# EAGLE design clk_shield (EAGLE 7.2.0)
CNAME: Arduino RTC shield; CREVISION: 001; DESIGNER: M.Vagovszky
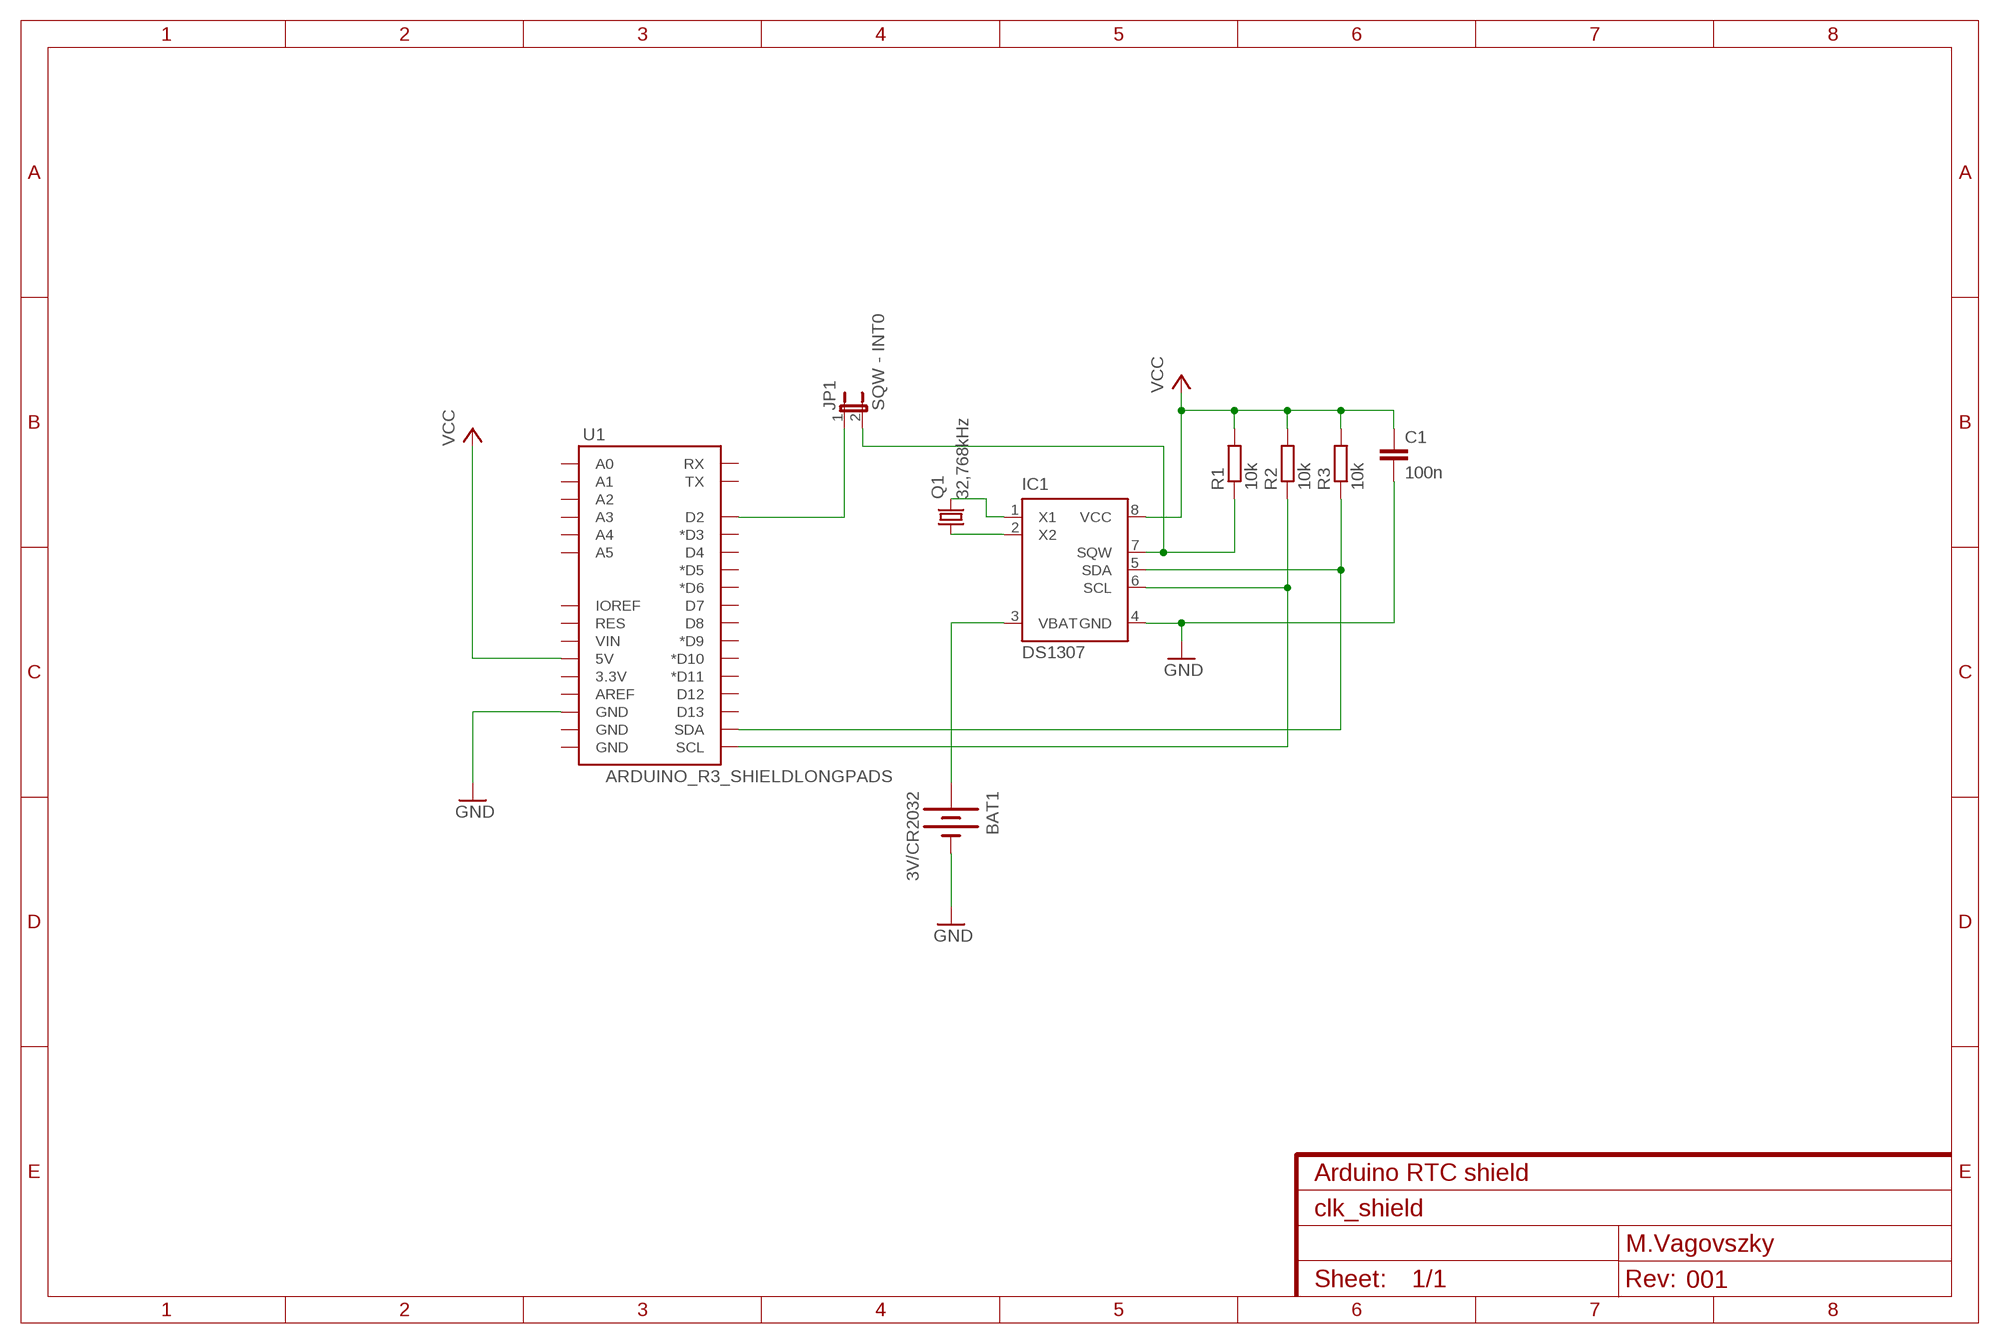
[diagram p0: schematic, sheet 1]

## Parts
BAT1  3V/CR2032  BATTERY20PTH  [BATTCOM_20MM_PTH]
C1  100n  C-EU050-025X075  [C050-025X075]
IC1  DS1307  [DIP-8]
JP1  SQW - INT0  JUMPER-2PTH  [1X02]
Q1  32,768kHz  CRYSTALTC26H  [TC26H]
R1  10k  R-EU_0207/12  [0207/12]
R2  10k  R-EU_0207/12  [0207/12]
R3  10k  R-EU_0207/12  [0207/12]
U1  ARDUINO_R3_SHIELDLONGPADS  [UNO_R3_SHIELD_LONGPADS]

## Nets
GND: BAT1.2(-) C1.2 IC1.4(GND) U1.GND@2(GND)
N$1: BAT1.1(+) IC1.3(VBAT)
N$2: IC1.1(X1) Q1.2
N$3: IC1.2(X2) Q1.1
N$5: IC1.6(SCL) R2.1 U1.SCL
N$6: IC1.5(SDA) R3.1 U1.SDA
N$7: JP1.1 U1.D2
N$8: IC1.7(SQW) JP1.2 R1.1
VCC: C1.1 IC1.8(VCC) R1.2 R2.2 R3.2 U1.5V
Unconnected: U1.3.3V U1.A0 U1.A1 U1.A2 U1.A3 U1.A4 U1.A5 U1.AREF U1.D3(*D3) U1.D4 U1.D5(*D5) U1.D6(*D6) U1.D7 U1.D8 U1.D9(*D9) U1.D10(*D10) U1.D11(*D11) U1.D12 U1.D13 U1.GND@0(GND) U1.GND@1(GND) U1.IOREF U1.RES U1.RX U1.TX U1.VIN

## Library data of the parts
BAT1 = My-Electromechanical:BATTERY: Battery Holders Various common sizes : AA, AAA, 20mm coin cell and 12mm coin cell. 20MM_4LEGS, BATT-10373
C1 = my_rcl:C-EU: CAPACITOR, European symbol
IC1 = DS1307:DS1307: DS1307 - 64×8, Serial, I2C Real Time Clock
JP1 = SparkFun-Retired:JUMPER-2: Jumper Basic 0.1" spaced jumper. Use with breakaway headers.
Q1 = my_crystal:CRYSTAL: CRYSTAL; OC_FARNELL: unknown; OC_NEWARK: unknown
R1-R3 = my_rcl:R-EU_: RESISTOR, European symbol
U1 = My:ARDUINO_R3_SHIELD: Shield form compatible with the Arduino Uno R3.

## Board
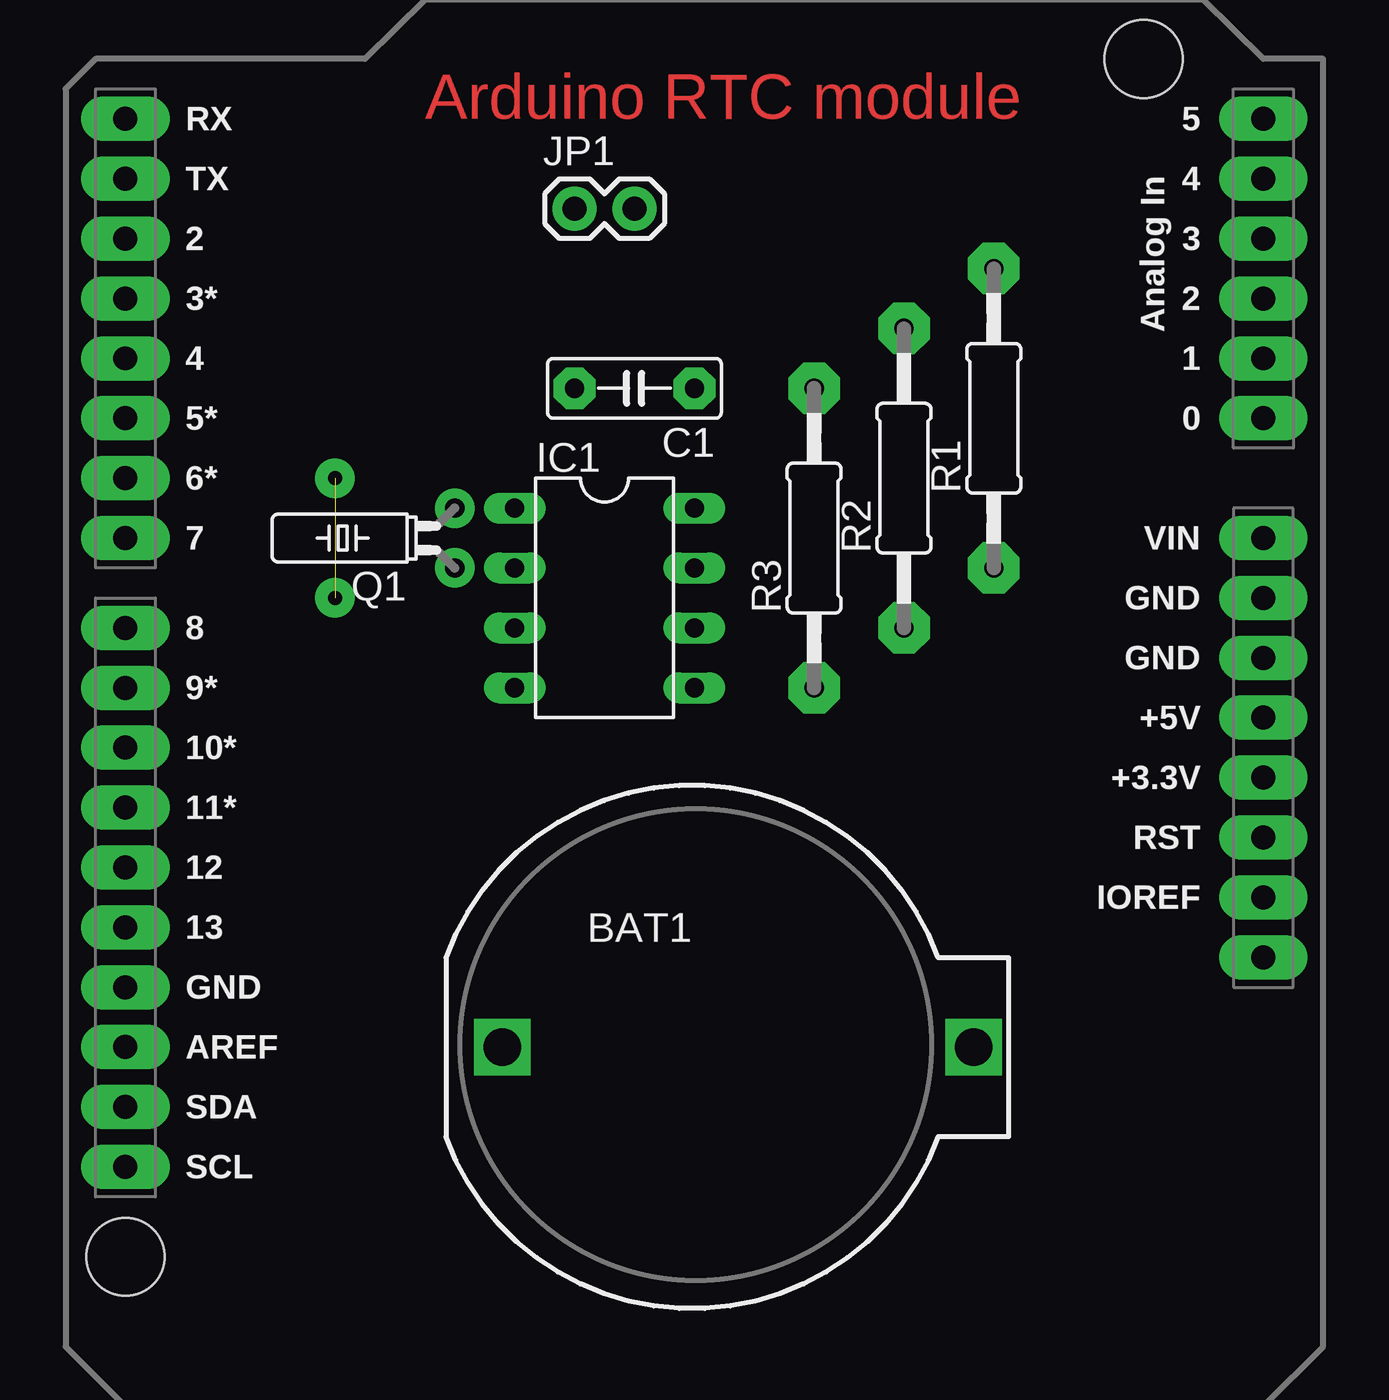
[diagram p1: board, top side]
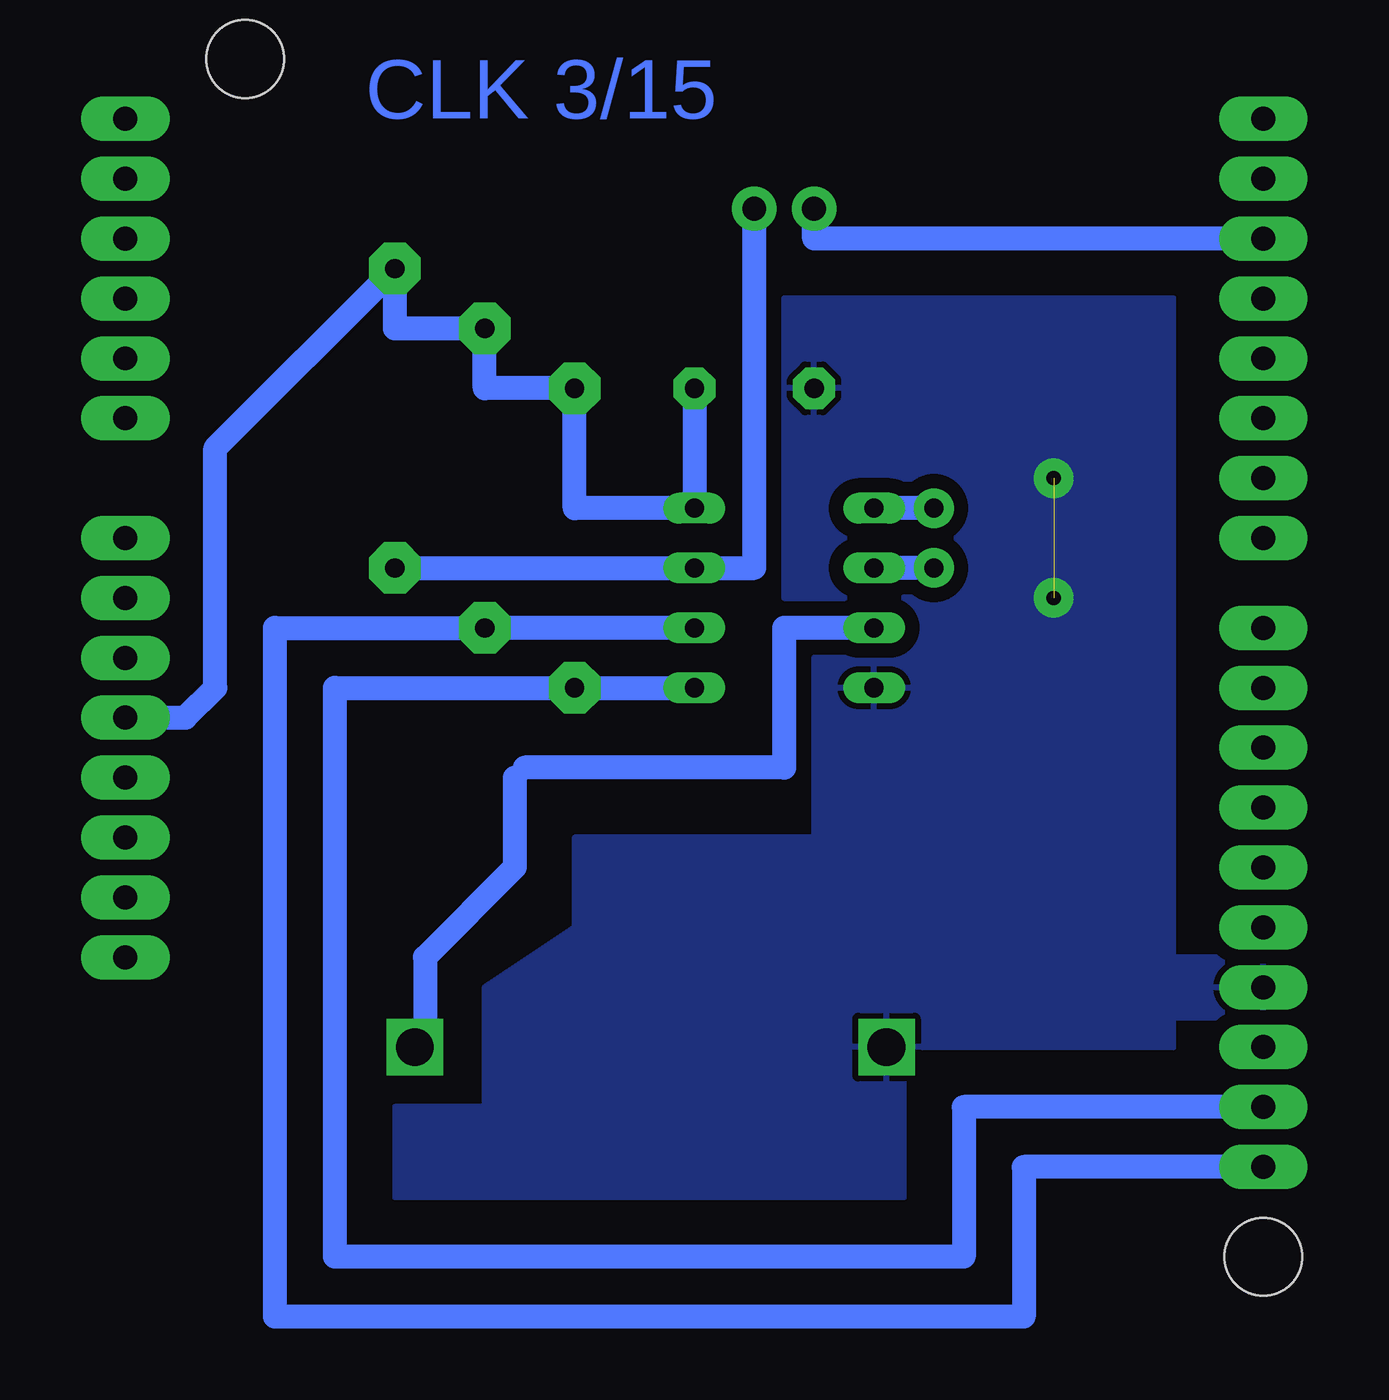
[diagram p2: board, bottom side, seen from below]

No outline drawn. Coordinates in mm, seen from the top.
Copper layers (1*16): Top 0.035mm / dielectric 1.5mm / Bottom 0.035mm
Design rules "default": minimum track width 10mil, minimum drill 24mil, track to track 8mil, track to pad 8mil, pad to pad 8mil, via to via 8mil, smd to smd 8mil, copper to edge 40mil, drill to drill 8mil, minimum pad ring 10mil, minimum via ring 8mil, stop-mask expansion 4mil, vias tented up to drill 0mil, thermal gap 10mil

### Footprints (pad centres in the part's own frame; a part is rotated, then mirrored left to right if it is on the bottom)
BATTCOM_20MM_PTH = drill 1.6 square: 1 11.85,0; 2 -8.15,0
C050-025X075 = drill 0.813 pad 1.778 octagon: 1 -2.54,0; 2 2.54,0
DIP-8 = drill 0.813 long: 1 -3.81,-3.81; 2 -1.27,-3.81; 3 1.27,-3.81; 4 3.81,-3.81; 5 3.81,3.81; 6 1.27,3.81; 7 -1.27,3.81; 8 -3.81,3.81
1X02 = drill 1.016 pad 1.88: 1 0,0; 2 2.54,0
TC26H = drill 0.813 pad 1.676: 1 -1.27,0; 2 1.27,0
0207/12 = drill 0.813 pad 2.184 octagon: 1 -6.35,0; 2 6.35,0
UNO_R3_SHIELD_LONGPADS = drill 1.016 pad 1.88 long: 3.3V 50.8,26.67; 5V 50.8,29.21; A0 50.8,41.91; A1 50.8,44.45; A2 50.8,46.99; A3 50.8,49.53; A4 50.8,52.07; A5 50.8,54.61; AREF 2.54,15.24; D2 2.54,49.53; D3 2.54,46.99; D4 2.54,44.45; D5 2.54,41.91; D6 2.54,39.37; D7 2.54,36.83; D8 2.54,33.02; D9 2.54,30.48; D10 2.54,27.94; D11 2.54,25.4; D12 2.54,22.86; D13 2.54,20.32; GND@0 50.8,31.75; GND@1 50.8,34.29; GND@2 2.54,17.78; IOREF 50.8,21.59; NC 50.8,19.05; RES 50.8,24.13; RX 2.54,54.61; SCL 2.54,10.16; SDA 2.54,12.7; TX 2.54,52.07; VIN 50.8,36.83 | hole 3.302: 45.72,57.15; 2.54,6.35

### Placement (x,y rotation side)
BAT1  26.67,15.24 0 top
C1  24.13,43.18 180 top
IC1  22.86,34.29 270 top
JP1  21.59,50.8 0 top
Q1  16.51,36.83 90 top
R1  39.37,41.91 90 top
R2  35.56,39.37 90 top
R3  31.75,36.83 90 top
U1  0,0 0 top

### Tracks (layer width: path | path; a pad name or v marks a point on that pad's centre or on a via)
GND  (via drill 0.6 pad 1.68)  (1 unrouted)
  other vias: 11.43,39.37 11.43,34.29
  pour Bottom (isolate 0.61): 22.86,46.99 22.86,34.29 17.78,34.29 17.78,31.75 21.59,31.75 21.59,24.13 31.75,24.13 31.75,20.32 35.56,17.78 35.56,12.7 39.37,12.7 39.37,8.89 17.78,8.89 17.78,15.24 6.35,15.24 6.35,16.51 1.27,16.51 1.27,19.05 6.35,19.05 6.35,46.99
N$1
  Bottom 0.406: 33.87,27.09 34.29,26.67
  Bottom 1.016: IC1.3 22.86,33.02 22.86,27.09 33.87,27.09 | 34.29,26.67 34.29,22.86 38.1,19.05 38.1,15.66 BAT1.1
N$2
  Bottom 1.016: Q1.2 IC1.1
N$3
  Bottom 1.016: Q1.1 IC1.2
N$5
  Bottom 1.016: IC1.6 R2.1 44.45,33.02 44.45,3.81 12.7,3.81 12.7,10.16 U1.SCL
N$6
  Bottom 0.406: 36.83,30.48 R3.1
  Bottom 1.016: U1.SDA 15.24,12.7 15.24,6.35 41.91,6.35 41.91,30.48 R3.1 IC1.5
N$7
  Bottom 1.016: U1.D2 21.59,49.53 JP1.1
N$8
  Bottom 1.016: R1.1 IC1.7 24.13,35.56 JP1.2
VCC
  Bottom 1.016: U1.5V 48.26,29.21 46.99,30.48 46.99,40.64 R1.2 39.37,45.72 R2.2 35.56,43.18 R3.2 31.75,38.1 IC1.8 C1.1

### Text on the board
Top: Arduino RTC module
Bottom: CLK 3/15